# Altium project AudioBox.PrjPcb
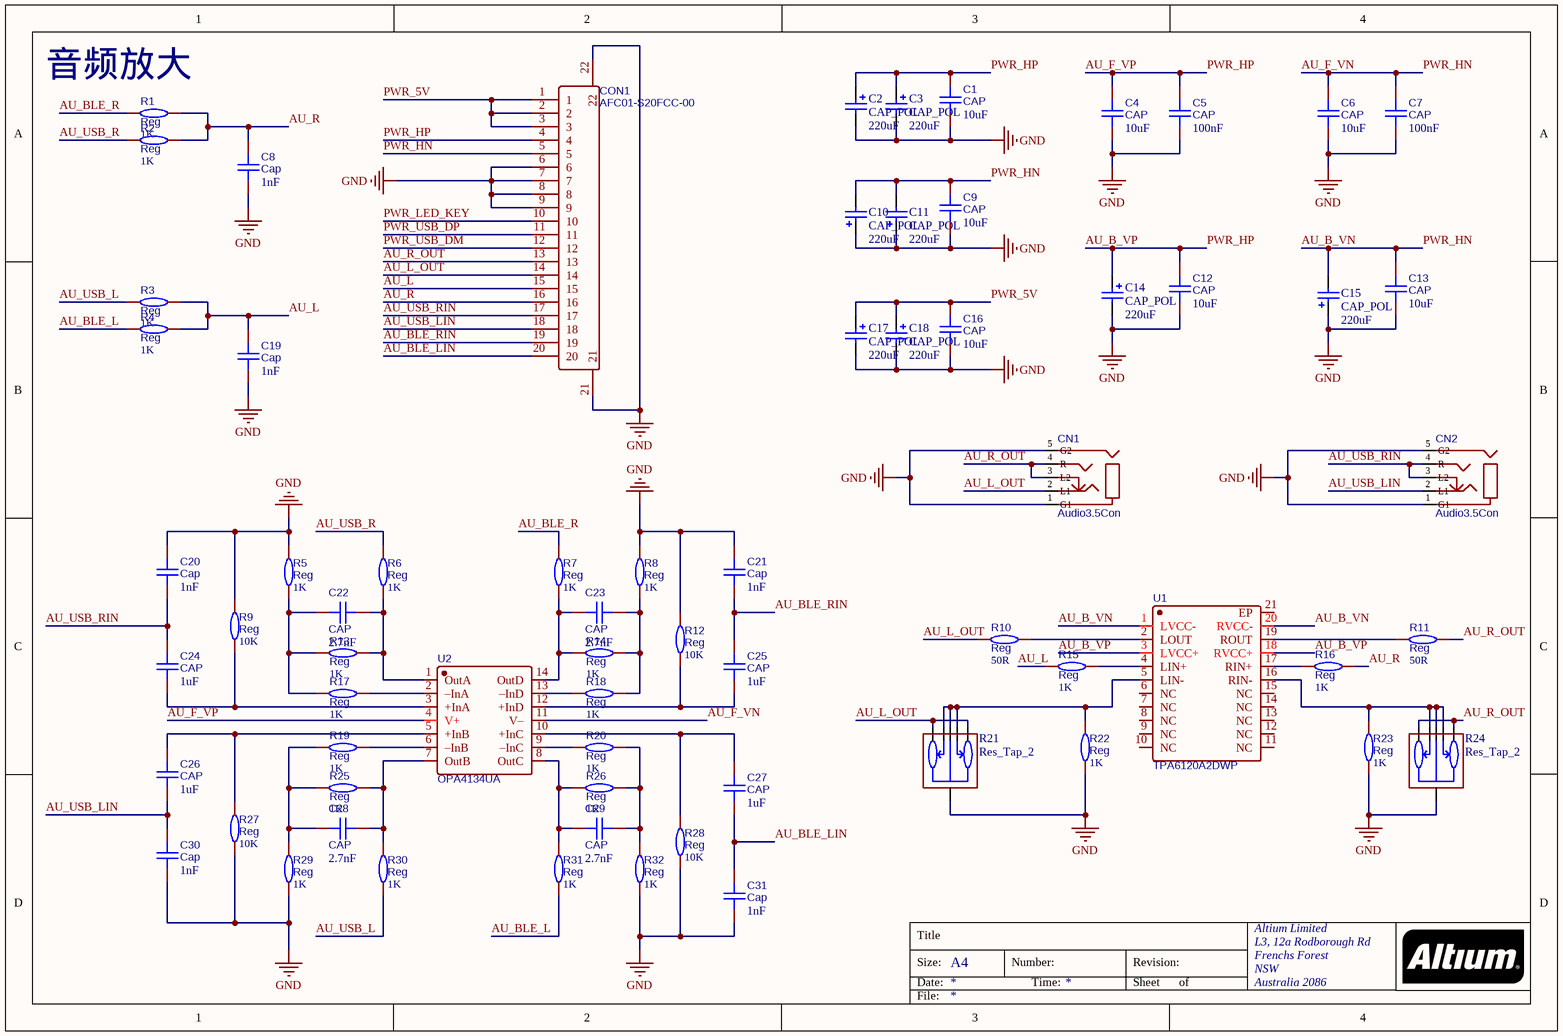
[diagram p0: Audio_Amp.SchDoc]
4 sheets, 182 parts. Net scope: global (net labels, ports and power ports of the same name join across sheets).
Board files: AudioBoxAmp.PcbDoc, Target.PcbDoc
Sheets:
  Audio_Amp.SchDoc
  Audio_Power.SchDoc
  DAC_BLE.SchDoc
  DAC_USB.SchDoc

## Sheet Audio_Amp.SchDoc
size A4; Organization: Altium Limited; Address1: L3, 12a Rodborough Rd; Address2: Frenchs Forest; Address3: NSW; Address4: Australia 2086

### Parts
C1  CAP  value 10uF  [C0603]
C2  CAP_POL  value 220uF  [CAP_SMD_6.3mm]
C3  CAP_POL  value 220uF  [CAP_SMD_6.3mm]
C4  CAP  value 10uF  [C0603]
C5  CAP  value 100nF  [C0603]
C6  CAP  value 10uF  [C0603]
C7  CAP  value 100nF  [C0603]
C8  Cap  value 1nF  [C0603]
C9  CAP  value 10uF  [C0603]
C10  CAP_POL  value 220uF  [CAP_SMD_6.3mm]
C11  CAP_POL  value 220uF  [CAP_SMD_6.3mm]
C12  CAP  value 10uF  [C0603]
C13  CAP  value 10uF  [C0603]
C14  CAP_POL  value 220uF  [CAP_SMD_6.3mm]
C15  CAP_POL  value 220uF  [CAP_SMD_6.3mm]
C16  CAP  value 10uF  [C0603]
C17  CAP_POL  value 220uF  [CAP_SMD_6.3mm]
C18  CAP_POL  value 220uF  [CAP_SMD_6.3mm]
C19  Cap  value 1nF  [C0603]
C20  Cap  value 1nF  [C0603]
C21  Cap  value 1nF  [C0603]
C22  CAP  value 2.7nF  [C0603]
C23  CAP  value 2.7nF  [C0603]
C24  CAP  value 1uF  [C0603]
C25  CAP  value 1uF  [C0603]
C26  CAP  value 1uF  [C0603]
C27  CAP  value 1uF  [C0603]
C28  CAP  value 2.7nF  [C0603]
C29  CAP  value 2.7nF  [C0603]
C30  Cap  value 1nF  [C0603]
C31  Cap  value 1nF  [C0603]
CN1  Audio3.5Con  [Audio3.5_3Pin]
CN2  Audio3.5Con  [Audio3.5_3Pin]
CON1  AFC01-S20FCC-00  [FPC-SMD_20P_0.5]
R1  Reg  value 1K  [R0603]
R2  Reg  value 1K  [R0603]
R3  Reg  value 1K  [R0603]
R4  Reg  value 1K  [R0603]
R5  Reg  value 1K  [R0603]
R6  Reg  value 1K  [R0603]
R7  Reg  value 1K  [R0603]
R8  Reg  value 1K  [R0603]
R9  Reg  value 10K  [R0603]
R10  Reg  value 50R  [R0603]
R11  Reg  value 50R  [R0603]
R12  Reg  value 10K  [R0603]
R13  Reg  value 1K  [R0603]
R14  Reg  value 1K  [R0603]
R15  Reg  value 1K  [R0603]
R16  Reg  value 1K  [R0603]
R17  Reg  value 1K  [R0603]
R18  Reg  value 1K  [R0603]
R19  Reg  value 1K  [R0603]
R20  Reg  value 1K  [R0603]
R21  Res_Tap_2  [RES_TAP_5Pin]
R22  Reg  value 1K  [R0603]
R23  Reg  value 1K  [R0603]
R24  Res_Tap_2  [RES_TAP_5Pin]
R25  Reg  value 1K  [R0603]
R26  Reg  value 1K  [R0603]
R27  Reg  value 10K  [R0603]
R28  Reg  value 10K  [R0603]
R29  Reg  value 1K  [R0603]
R30  Reg  value 1K  [R0603]
R31  Reg  value 1K  [R0603]
R32  Reg  value 1K  [R0603]
U1  TPA6120A2DWP  [HSOP-20]
U2  OPA4134UA  [SOIC-14]

### Nets
GND: C1.1 C2.2 C3.2 C4.1 C5.1 C6.1 C7.1 C8.1 C9.1 C10.1 C11.1 C12.1 C13.1 C14.2 C15.1 C16.1 C17.2 C18.2 C19.1 C20.2 C21.2 C30.2 C31.1 CN1.1(G1) CN1.5(G2) CN2.1(G1) CN2.5(G2) CON1.6 CON1.7 CON1.8 CON1.9 CON1.21 CON1.22 R5.2 R8.2 R9.1 R12.1 R21.6(PAD) R22.1 R23.1 R24.6(PAD) R27.2 R28.2 R29.1 R32.1  [project net AGND]
AU_B_VN: C6.2 C7.2 C9.2 C10.2 C11.2 C13.2 C15.2 CON1.5 U1.1(LVCC-) U1.20(RVCC-) U2.11(V–)  [also labelled AU_F_VN, PWR_HN]
AU_B_VP: C1.2 C2.1 C3.1 C4.2 C5.2 C12.2 C14.1 CON1.4 U1.3(LVCC+) U1.18(RVCC+) U2.4(V+)  [also labelled AU_F_VP, PWR_HP]
AU_BLE_L: R4.2 R31.1
AU_BLE_LIN: C27.1 C31.2 CON1.20
AU_BLE_R: R1.2 R7.2
AU_BLE_RIN: C21.1 C25.2 CON1.19
AU_L: C19.2 CON1.15 R3.1 R4.1 R15.1
AU_L_OUT: CN1.2(L1) CON1.14 R10.1 R21.4(CH2B) R21.5(CH1B)
AU_R: C8.2 CON1.16 R1.1 R2.1 R16.2
AU_R_OUT: CN1.3(L2) CN1.4(R) CON1.13 R11.2 R24.4(CH2B) R24.5(CH1B)
AU_USB_L: R3.2 R30.1
AU_USB_LIN: C26.2 C30.1 CN2.2(L1) CON1.18
AU_USB_R: R2.2 R6.2
AU_USB_RIN: C20.1 C24.1 CN2.3(L2) CN2.4(R) CON1.17
PWR_5V: C16.2 C17.1 C18.1 CON1.1 CON1.2 CON1.3
PWR_LED_KEY: CON1.10
PWR_USB_DM: CON1.12
PWR_USB_DP: CON1.11
NetC22_1: C22.1 R5.1 R13.2 R17.2
NetC22_2: C22.2 R6.1 R13.1 U2.1(OutA)
NetC23_1: C23.1 R7.1 R14.2 U2.14(OutD)
NetC23_2: C23.2 R8.1 R14.1 R18.1
NetC24_2: C24.2 R9.2 U2.3(+InA)
NetC25_1: C25.1 R12.2 U2.12(+InD)
NetC26_1: C26.1 R27.1 U2.5(+InB)
NetC27_2: C27.2 R28.1 U2.10(+InC)
NetC28_1: C28.1 R19.2 R25.2 R29.2
NetC28_2: C28.2 R25.1 R30.2 U2.7(OutB)
NetC29_1: C29.1 R26.2 R31.2 U2.8(OutC)
NetC29_2: C29.2 R20.1 R26.1 R32.2
NetR10_2: R10.2 U1.2(LOUT)
NetR11_1: R11.1 U1.19(ROUT)
NetR15_2: R15.2 U1.4(LIN+)
NetR16_1: R16.1 U1.17(RIN+)
NetR17_1: R17.1 U2.2(–InA)
NetR18_2: R18.2 U2.13(–InD)
NetR19_1: R19.1 U2.6(–InB)
NetR20_2: R20.2 U2.9(–InC)
NetR21_1: R21.1(G) R21.2(CH1A) R21.3(CH2A) R22.2 U1.5(LIN-)
NetR23_2: R23.2 R24.1(G) R24.2(CH1A) R24.3(CH2A) U1.16(RIN-)

Not connected (* = marked no-connect by the designer): U1 6(NC) 7(NC) 8(NC) 9(NC) 10(NC) 11(NC) 12(NC) 13(NC) 14(NC) 15(NC) 21(EP)

### Notes on the sheet
- (near R1) 音频放大
- Title
- Size:
- Date:
- A4
- Number:
- Time:
- Revision:
- Sheet
- of
- File:

### Library data of the parts
C1 C4-C9 C12 C13 C16 C19-C31 = CAP: BOM_Manufacturer: Huaxin S&T; BOM_Manufacturer Part: 0603B103K101CT; nameAlias: Capacitance; Contributor: LCSC; BOM_Supplier: LCSC; BOM_Supplier Part: C302008; spicePre: C; spiceSymbolName: 0603B103K101CT
C2 C3 C10 C11 C14 C15 C17 C18 = CAP_POL: 极性电容
CN1 CN2 = AudioCon3: 3.5mm 3Pin 音频接口; BOM_Manufacturer: G-Switch(品赞); BOM_Manufacturer Part: PJ-393; Contributor: LCSC; BOM_Supplier: LCSC; BOM_Supplier Part: C2837065; BOM_JLCPCB Part Class: Extended Part; spicePre: C; spiceSymbolName: PJ-393_C2837065
CON1 = FPC_CONN_20: FPC连接器20Pin; BOM_Manufacturer: JUSHUO; Contributor: LCSC; BOM_Supplier: LCSC; BOM_Supplier Part: C262274; BOM_Manufacturer Part: AFC01-S20FCC-00; BOM_JLCPCB Part Class: Extended Part; spicePre: F; spiceSymbolName: AFC01-S20FCC-00
R1-R20 R22 R23 R25-R32 = Res: 电阻; BOM_Manufacturer: Viking Tech; BOM_Manufacturer Part: AR03BTCX1002A; nameAlias: Resistance (Ohms); Contributor: LCSC; BOM_Supplier: LCSC; BOM_Supplier Part: C465721; spicePre: R; spiceSymbolName: AR03BTCX1002A
R21 R24 = Res_Tap_2: 双联电位器
U1 = TPA6120: 耳放; BOM_Manufacturer: TI(德州仪器); Contributor: LCSC; BOM_Supplier: LCSC; BOM_Supplier Part: C2871054; BOM_Manufacturer Part: TPA6120A2DWP; link: https://atta.szlcsc.comnull; spicePre: U; spiceSymbolName: TPA6120A2DWP
U2 = OPA4134UA: 耳放; BOM_Manufacturer: TI(德州仪器); Contributor: LCSC; BOM_Supplier: LCSC; BOM_Supplier Part: C2832240; BOM_Manufacturer Part: OPA4134UA; BOM_JLCPCB Part Class: Extended Part; spicePre: U; spiceSymbolName: OPA4134UA

## Sheet Audio_Power.SchDoc
size A4; Organization: Altium Limited; Address1: L3, 12a Rodborough Rd; Address2: Frenchs Forest; Address3: NSW; Address4: Australia 2086
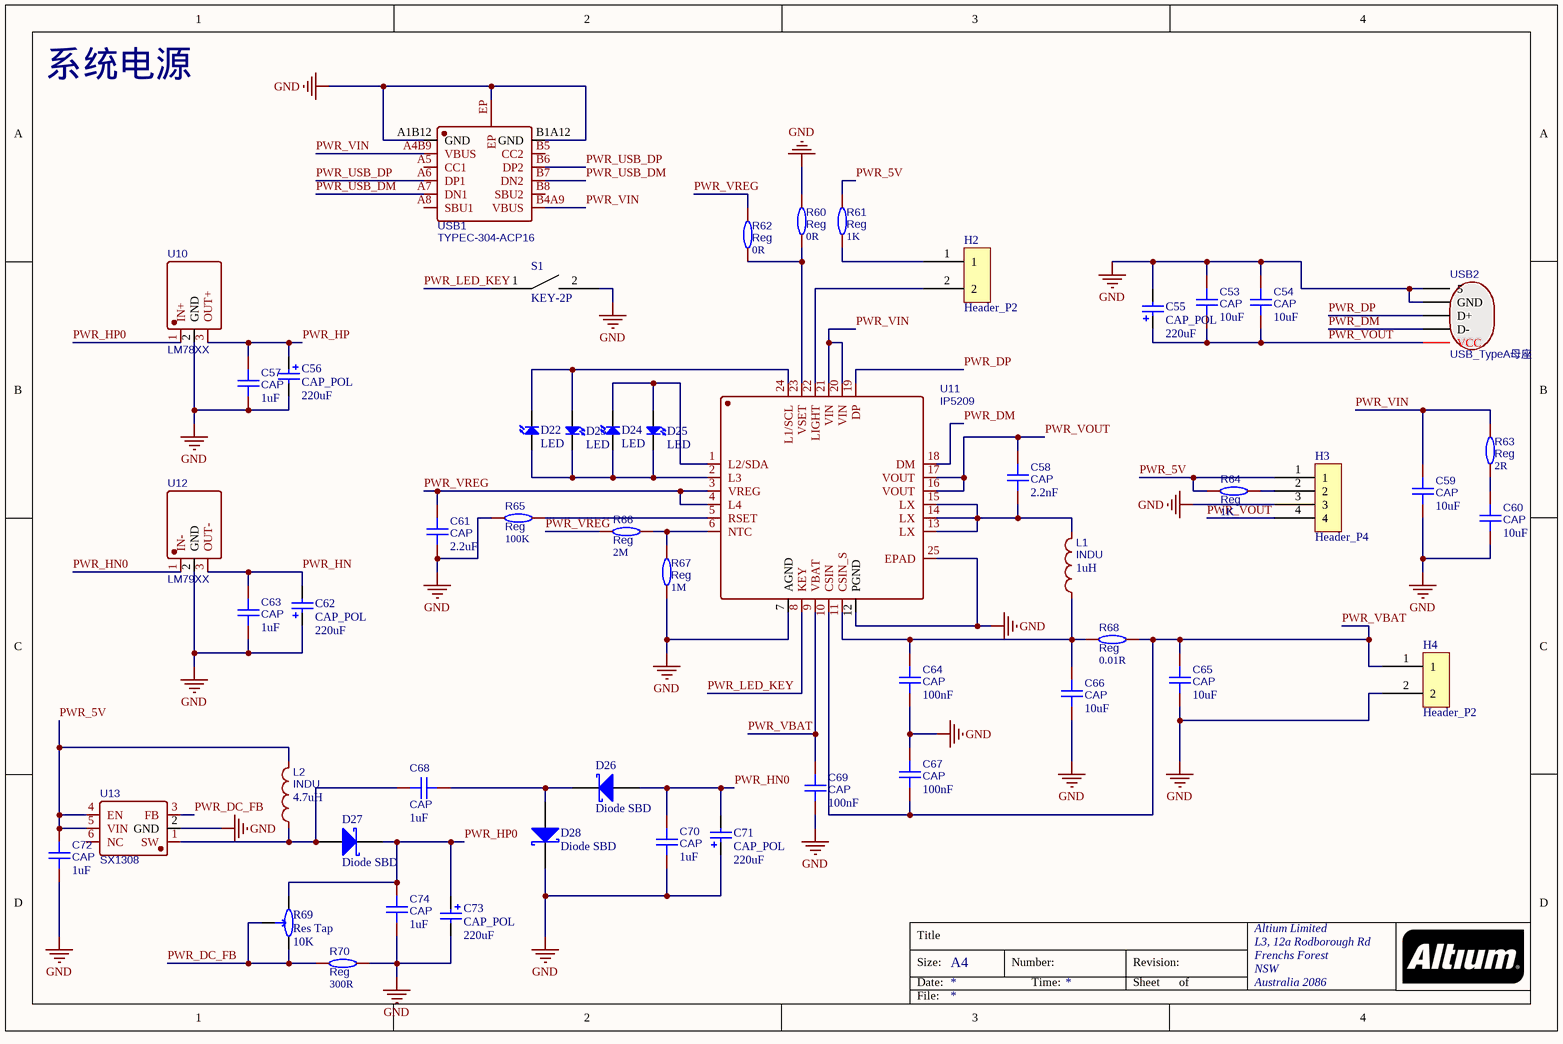
[diagram p1: Audio_Power.SchDoc]

### Parts
C53  CAP  value 10uF  [C0603]
C54  CAP  value 10uF  [C0603]
C55  CAP_POL  value 220uF  [CAP_SMD_6.3mm]
C56  CAP_POL  value 220uF  [CAP_SMD_6.3mm]
C57  CAP  value 1uF  [C0603]
C58  CAP  value 2.2nF  [C0603]
C59  CAP  value 10uF  [C0603]
C60  CAP  value 10uF  [C0603]
C61  CAP  value 2.2uF  [C0603]
C62  CAP_POL  value 220uF  [CAP_SMD_6.3mm]
C63  CAP  value 1uF  [C0603]
C64  CAP  value 100nF  [C0603]
C65  CAP  value 10uF  [C0603]
C66  CAP  value 10uF  [C0603]
C67  CAP  value 100nF  [C0603]
C68  CAP  value 1uF  [C0603]
C69  CAP  value 100nF  [C0603]
C70  CAP  value 1uF  [C0603]
C71  CAP_POL  value 220uF  [CAP_SMD_6.3mm]
C72  CAP  value 1uF  [C0603]
C73  CAP_POL  value 220uF  [CAP_SMD_6.3mm]
C74  CAP  value 1uF  [C0603]
D22  LED  [LED0603_Side]
D23  LED  [LED0603_Side]
D24  LED  [LED0603_Side]
D25  LED  [LED0603_Side]
D26  Diode SBD  [SMA_L4.3]
D27  Diode SBD  [SMA_L4.3]
D28  Diode SBD  [SMA_L4.3]
H2  Header_P2  [H_2.54_P2]
H3  Header_P4  [H_2.54_P4]
H4  Header_P2  [H_2.54_P2]
L1  INDU  value 1uH  [SMD_L7.1]
L2  INDU  value 4.7uH  [SMD_L7.1]
R60  Reg  value 0R  [R0603]
R61  Reg  value 1K  [R0603]
R62  Reg  value 0R  [R0603]
R63  Reg  value 2R  [R0603]
R64  Reg  value 1K  [R0603]
R65  Reg  value 100K  [R0603]
R66  Reg  value 2M  [R0603]
R67  Reg  value 1M  [R0603]
R68  Reg  value 0.01R  [R1206]
R69  Res Tap  value 10K  [RES_TAP_HOR]
R70  Reg  value 300R  [R0603]
S1  KEY-2P  [KEY_SOT_P2]
U10  LM78XX  [TO-220-3_2.54]
U11  IP5209  [QFN-24]
U12  LM79XX  [TO-220-3_2.54]
U13  SX1308  [SOT-23-6]
USB1  TYPEC-304-ACP16  [USB-C-SMD_TYPE-C-16P]
USB2  USB_TypeA母座  [USB_TYPEA-SMD]

### Nets
GND: C53.1 C54.1 C55.2 C56.2 C57.2 C59.2 C60.2 C61.2 C62.1 C63.2 C64.2 C65.2 C66.2 C67.1 C69.2 C70.2 C71.1 C72.2 C73.2 C74.2 D28.1(K) H3.3 H4.2 R60.2 R65.2 R67.2 R70.2 S1.2 U10.2(GND) U11.7(AGND) U11.12(PGND) U11.25(EPAD) U12.2(GND) U13.2(GND) USB1.A1B12(GND) USB1.B1A12(GND) USB1.EP USB2.4(GND) USB2.5  [project net AGND]
PWR_5V: C72.1 H3.1 L2.2 R61.2 R64.1 U13.4(EN) U13.5(VIN)
PWR_DC_FB: R69.1(A) R69.3(TAP) R70.1 U13.3(FB)
PWR_DM: U11.18(DM) USB2.2(D-)
PWR_DP: U11.19(DP) USB2.3(D+)
PWR_HN: C62.2 C63.1 U12.3(OUT-)  [project net AU_B_VN]
PWR_HN0: C70.1 C71.2 D26.2(A) U12.1(IN-)
PWR_HP: C56.1 C57.1 U10.3(OUT+)  [project net AU_B_VP]
PWR_HP0: C73.1 C74.1 D27.1(K) R69.2(B) U10.1(IN+)
PWR_LED_KEY: S1.1 U11.8(KEY)
PWR_USB_DM: USB1.A7(DN1) USB1.B7(DN2)
PWR_USB_DP: USB1.A6(DP1) USB1.B6(DP2)
PWR_VBAT: C65.1 C67.2 C69.1 H4.1 R68.2 U11.9(VBAT) U11.10(CSIN)
PWR_VIN: C59.1 R63.2 U11.20(VIN) U11.21(VIN) USB1.A4B9(VBUS) USB1.B4A9(VBUS)
PWR_VOUT: C53.2 C54.2 C55.1 C58.1 H3.4 U11.16(VOUT) U11.17(VOUT) USB2.1(VCC)
PWR_VREG: C61.1 R62.2 R66.2 U11.3(VREG) U11.4(L4)
NetC58_2: C58.2 L1.2 U11.13(LX) U11.14(LX) U11.15(LX)
NetC60_1: C60.1 R63.1
NetC64_1: C64.1 C66.1 L1.1 R68.1 U11.11(CSIN_S)
NetC68_1: C68.1 D27.2(A) L2.1 U13.1(SW)
NetC68_2: C68.2 D26.1(K) D28.2(A)
NetD22_1: D22.1(K) D23.2(A) U11.24(L1/SCL)
NetD22_2: D22.2(A) D23.1(K) D24.2(A) D25.1(K) U11.2(L3)
NetD24_1: D24.1(K) D25.2(A) U11.1(L2/SDA)
NetH2_1: H2.1 R61.1
NetH2_2: H2.2 U11.22(LIGHT)
NetH3_2: H3.2 R64.2
NetR60_1: R60.1 R62.1 U11.23(VSET)
NetR65_1: R65.1 U11.5(RSET)
NetR66_1: R66.1 R67.1 U11.6(NTC)

Not connected (* = marked no-connect by the designer): U13 6(NC); USB1 A5(CC1) A8(SBU1) B5(CC2) B8(SBU2)

### Notes on the sheet
- 系统电源
- Title
- Size:
- Date:
- A4
- Number:
- Time:
- Revision:
- Sheet
- of
- File:

### Library data of the parts
C53 C54 C57-C61 C63-C70 C72 C74 = CAP: as C1 on sheet Audio_Amp; BOM_Supplier: LCSC; BOM_Supplier Part: C302008; spicePre: C; spiceSymbolName: 0603B103K101CT
C55 C56 C62 C71 C73 = CAP_POL: 极性电容
D22-D25 = LED0: Published: 8-Jun-2000; LatestRevisionDate: 08-Jul-2005; LatestRevisionNote: Mech Layer 1 removed.; PackageReference: LED-0; Publisher: Altium Limited; PackageDescription: LED; 2 Leads
D26-D28 = Diode SBD: Schottky Rectifier; Note: Terminal 2 is the TAB and is electrically connected to the cathode; Published: 8-Jun-2000; LatestRevisionDate: 17-Jul-2002; LatestRevisionNote: Re-released for DXP Platform.; DatasheetVersion: PD-2.057B; PackageVersion: Feb-1998; PackageReference: TO-220AC; Publisher: Altium Limited; PackageDescription: TO, Thru-Hole, Vertical, Heatsink Mounted; 3 In-Line Leads (1 Absent); Pitch 2.54 mm; ComponentLink1Description: Manufacturer Link; ComponentLink1URL: http://www.irf.com/; ComponentLink2Description: Datasheet; ComponentLink2URL: http://www.irf.com/product-info/datasheets/data/10tq.pdf
H2 H4 = Header_P2: 2Pin排针
H3 = Header_P4: 4Pin排针
L1 L2 = IND: 电感; BOM_Manufacturer: Sunltech Tech; BOM_Manufacturer Part: SLO0630H150MTT; nameAlias: Inductance; Contributor: LCSC; BOM_Supplier: LCSC; BOM_Supplier Part: C182182; BOM_JLCPCB Part Class: Extended Part; spicePre: L; spiceSymbolName: SLO0630H150MTT
R60-R68 R70 = Res: as R1 on sheet Audio_Amp; BOM_Supplier: LCSC; BOM_Supplier Part: C465721; spicePre: R; spiceSymbolName: AR03BTCX1002A
R69 = Res Tap: 可调电阻; Sim Note: Enter the Resistance value and the set point into parameter fields.; Set Position: 0.5; Published: 24-Mar-1999; LatestRevisionDate: 17-Jul-2002; LatestRevisionNote: Re-released for DXP Platform.; PackageReference: VR3; Publisher: Altium Limited; PackageDescription: Variable Resistor, Thru-Hole; 3 Leads
S1 = KEY_2P: KEY-2Pp
U10 = LM78XX: 三端稳压(正电压); BOM_Manufacturer: HGSEMI(华冠); BOM_Manufacturer Part: LM7812T; Contributor: LCSC; BOM_Supplier: LCSC; BOM_Supplier Part: C2902509; BOM_JLCPCB Part Class: Extended Part; spicePre: U; spiceSymbolName: LM7812T
U11 = IP5209: USB充电宝; BOM_Manufacturer: INJOINIC; Contributor: LCSC; BOM_Supplier: LCSC; BOM_Supplier Part: C181695; BOM_Manufacturer Part: IP5209; BOM_JLCPCB Part Class: Extended Part; spicePre: U; spiceSymbolName: IP5209
U12 = LM79XX: 三端稳压(负电压); BOM_Manufacturer: HGSEMI(华冠); BOM_Manufacturer Part: LM7812T; Contributor: LCSC; BOM_Supplier: LCSC; BOM_Supplier Part: C2902509; BOM_JLCPCB Part Class: Extended Part; spicePre: U; spiceSymbolName: LM7812T
U13 = SX1308: 升压PWM; BOM_Manufacturer: SX; sourceId: g4Yg9rJ1j; timeStamp: 1472247539; BOM_Supplier: LCSC; BOM_Manufacturer Part: SX1308; BOM_Supplier Part: C78162; BOM_JLCPCB Part Class: Extended Part; spicePre: U; spiceSymbolName: SX1308
USB1 = USB_TYPEC_12P: 全引脚USB TYPEC母座; BOM_Manufacturer: XUNPU(讯普); Contributor: LCSC; BOM_Supplier: LCSC; BOM_Supplier Part: C2982555; BOM_Manufacturer Part: TYPEC-304-ACP16; BOM_JLCPCB Part Class: Extended Part; spicePre: U; spiceSymbolName: TYPEC-304-ACP16
USB2 = USB-TYPEA: BOM_Manufacturer: ValuePro; BOM_Manufacturer Part: YJ-USB-AF-SMT-01; BOM_Supplier: LCSC; BOM_Supplier Part: C8328; BOM_JLCPCB Part Class: Extended Part; spicePre: U; spiceSymbolName: YJ-USB-AF-SMT-01

## Sheet DAC_BLE.SchDoc
size A4; Organization: Altium Limited; Address1: L3, 12a Rodborough Rd; Address2: Frenchs Forest; Address3: NSW; Address4: Australia 2086
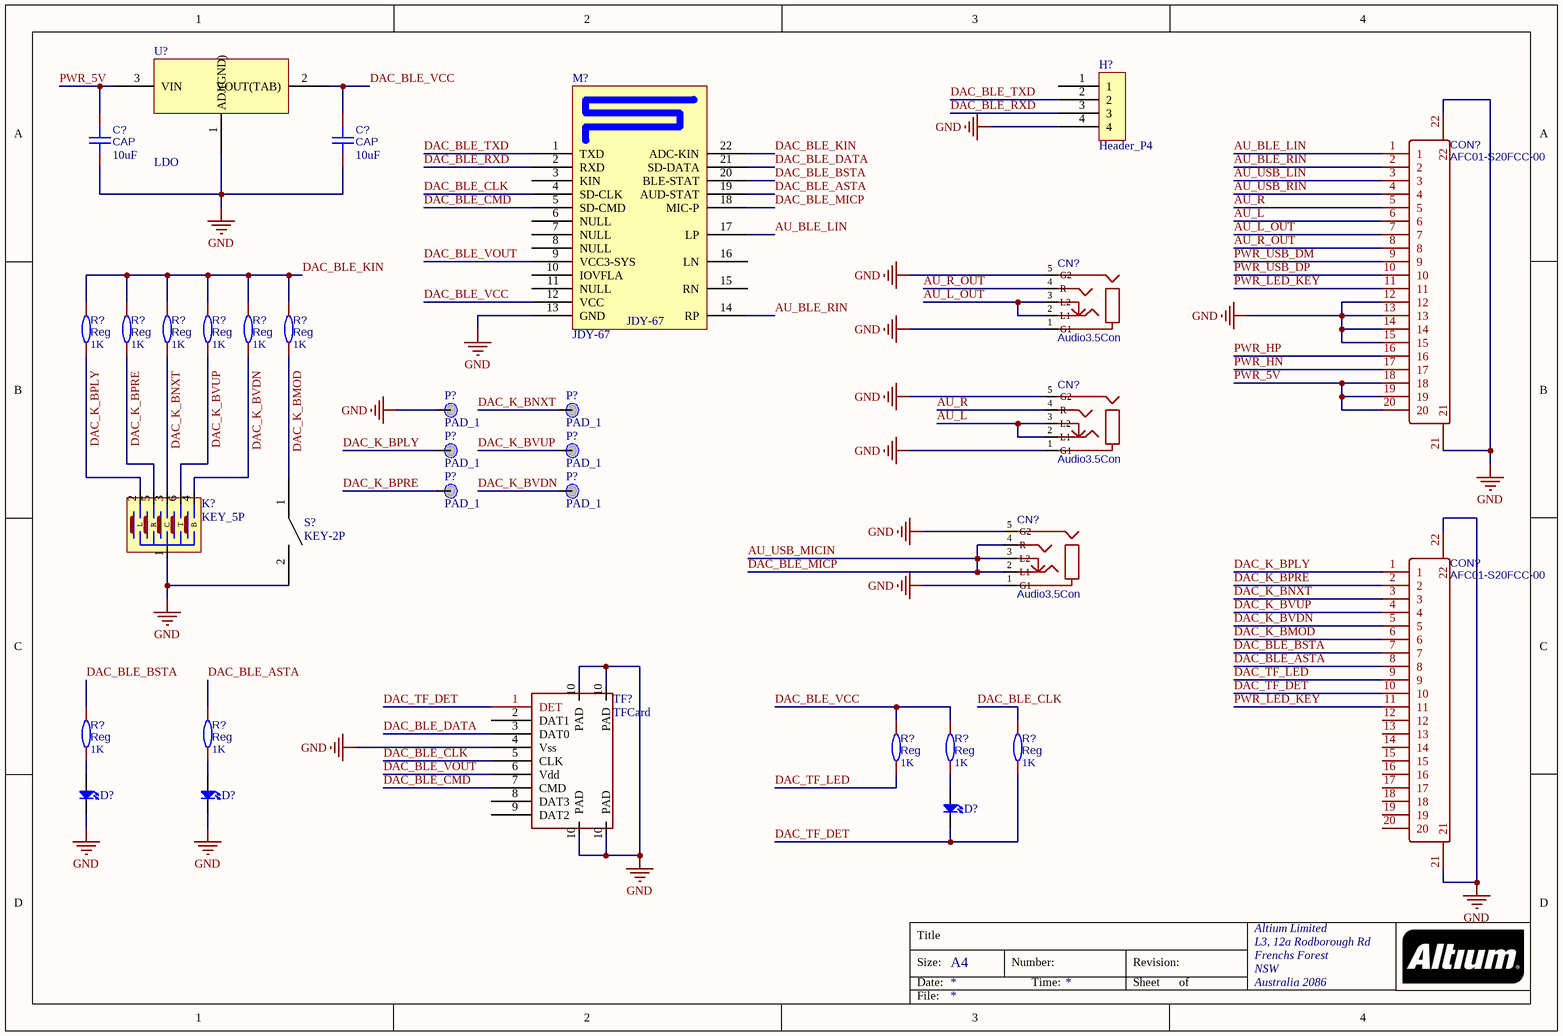
[diagram p2: DAC_BLE.SchDoc]

### Parts
(Parts that share a designator on the sheet are numbered #1, #2 ... from top to bottom, then left to right.)
C?#1  CAP  value 10uF  [C0603]
C?#2  CAP  value 10uF  [C0603]
CN?#1  Audio3.5Con  [Audio3.5_3Pin]
CN?#2  Audio3.5Con  [Audio3.5_3Pin]
CN?#3  Audio3.5Con  [Audio3.5_3Pin]
CON?#1  AFC01-S20FCC-00  [FPC-SMD_20P_0.5]
CON?#2  AFC01-S20FCC-00  [FPC-SMD_20P_0.5]
D?#1  LED  [LED0603]  (value not drawn)
D?#2  LED  [LED0603]  (value not drawn)
D?#3  LED  [LED0603]  (value not drawn)
H?  Header_P4  [H_1.27_P4]
K?#1  KEY_5P  [KEY_5]
M?  JDY-67  [JDY-67]
P?#1  PAD_1
P?#2  PAD_1
P?#3  PAD_1
P?#4  PAD_1
P?#5  PAD_1
P?#6  PAD_1
R?#1  Reg  value 1K  [R0603]
R?#2  Reg  value 1K  [R0603]
R?#3  Reg  value 1K  [R0603]
R?#4  Reg  value 1K  [R0603]
R?#5  Reg  value 1K  [R0603]
R?#6  Reg  value 1K  [R0603]
R?#7  Reg  value 1K  [R0603]
R?#8  Reg  value 1K  [R0603]
R?#9  Reg  value 1K  [R0603]
R?#10  Reg  value 1K  [R0603]
R?#11  Reg  value 1K  [R0603]
S?  KEY-2P  [KEY_SOT_P2]
TF?  TFCard
U?#1  LDO  [SOT-89]

### Nets
GND: C?#1.2 C?#2.2 CN?#1.1(G1) CN?#1.5(G2) CN?#2.1(G1) CN?#2.5(G2) CN?#3.1(G1) CN?#3.5(G2) CON?#1.12 CON?#1.13 CON?#1.14 CON?#1.15 CON?#1.21 CON?#1.22 CON?#2.21 CON?#2.22 D?#1.1(K) D?#2.1(K) H?.4 K?#1.1(G) M?.13(GND) P?#1.1 S?.2 TF?.4(Vss) TF?.10(PAD) U?#1.1(ADJ(GND))  [project net AGND]
AU_BLE_LIN: CON?#1.1 M?.17(LP)
AU_BLE_RIN: CON?#1.2 M?.14(RP)
AU_L: CN?#2.2(L1) CN?#2.3(L2) CON?#1.6
AU_L_OUT: CN?#1.2(L1) CN?#1.3(L2) CON?#1.7
AU_R: CN?#2.4(R) CON?#1.5
AU_R_OUT: CN?#1.4(R) CON?#1.8
AU_USB_LIN: CON?#1.3
AU_USB_MICIN: CN?#3.2(L1) CN?#3.3(L2) CN?#3.4(R) M?.18(MIC-P)  [also labelled DAC_BLE_MICP]
AU_USB_RIN: CON?#1.4
DAC_BLE_ASTA: CON?#2.8 M?.19(AUD-STAT) R?#8.2
DAC_BLE_BSTA: CON?#2.7 M?.20(BLE-STAT) R?#7.2
DAC_BLE_CLK: M?.4(SD-CLK) R?#11.2 TF?.5(CLK)
DAC_BLE_CMD: M?.5(SD-CMD) TF?.7(CMD)
DAC_BLE_DATA: M?.21(SD-DATA) TF?.3(DAT0)
DAC_BLE_KIN: M?.22(ADC-KIN) R?#1.2 R?#2.2 R?#3.2 R?#4.2 R?#5.2 R?#6.2
DAC_BLE_RXD: H?.3 M?.2(RXD)
DAC_BLE_TXD: H?.2 M?.1(TXD)
DAC_BLE_VCC: C?#2.1 M?.12(VCC) R?#9.2 R?#10.2 U?#1.2(VOUT(TAB))
DAC_BLE_VOUT: M?.9(VCC3-SYS) TF?.6(Vdd)
DAC_K_BMOD: CON?#2.6 R?#6.1 S?.1
DAC_K_BNXT: CON?#2.3 K?#1.3(C) P?#2.1 R?#3.1
DAC_K_BPLY: CON?#2.1 K?#1.2(L) P?#3.1 R?#1.1
DAC_K_BPRE: CON?#2.2 K?#1.5(R) P?#5.1 R?#2.1
DAC_K_BVDN: CON?#2.5 K?#1.4(B) P?#6.1 R?#5.1
DAC_K_BVUP: CON?#2.4 K?#1.6(T) P?#4.1 R?#4.1
DAC_TF_DET: CON?#2.10 D?#3.1(K) R?#11.1 TF?.1(DET)
DAC_TF_LED: CON?#2.9 R?#9.1
PWR_5V: C?#1.1 CON?#1.18 CON?#1.19 CON?#1.20 U?#1.3(VIN)
PWR_HN: CON?#1.17  [project net AU_B_VN]
PWR_HP: CON?#1.16  [project net AU_B_VP]
PWR_LED_KEY: CON?#1.11 CON?#2.11
PWR_USB_DM: CON?#1.9
PWR_USB_DP: CON?#1.10
NetD?#1_2: D?#1.2(A) R?#7.1
NetD?#2_2: D?#2.2(A) R?#8.1
NetD?#3_2: D?#3.2(A) R?#10.1

Not connected (* = marked no-connect by the designer): CON?#2 12 13 14 15 16 17 18 19 20; H? 1; M? 3(KIN) 6(NULL) 7(NULL) 8(NULL) 10(IOVFLA) 11(NULL) 15(RN) 16(LN); TF? 2(DAT1) 8(DAT3) 9(DAT2)

### Notes on the sheet
- Title
- Size:
- Date:
- A4
- Number:
- Time:
- Revision:
- Sheet
- of
- File:

### Library data of the parts
C?#1 C?#2 = CAP: as C1 on sheet Audio_Amp; BOM_Supplier: LCSC; BOM_Supplier Part: C302008; spicePre: C; spiceSymbolName: 0603B103K101CT
CN?#1-CN?#3 = AudioCon3: as CN1 on sheet Audio_Amp; BOM_Supplier: LCSC; BOM_Supplier Part: C2837065; BOM_JLCPCB Part Class: Extended Part; spicePre: C; spiceSymbolName: PJ-393_C2837065
CON?#1 CON?#2 = FPC_CONN_20: as CON1 on sheet Audio_Amp; BOM_Supplier: LCSC; BOM_Supplier Part: C262274; BOM_Manufacturer Part: AFC01-S20FCC-00; BOM_JLCPCB Part Class: Extended Part; spicePre: F; spiceSymbolName: AFC01-S20FCC-00
D?#1-D?#3 = LED0: Published: 8-Jun-2000; LatestRevisionDate: 08-Jul-2005; LatestRevisionNote: Mech Layer 1 removed.; PackageReference: LED-0; Publisher: Altium Limited; PackageDescription: LED; 2 Leads
H? = Header_P4: 4Pin排针
K?#1 = KEY_5P: 五向开关
P?#1-P?#6 = PAD_1: 1脚焊盘
R?#1-R?#11 = Res: as R1 on sheet Audio_Amp; BOM_Supplier: LCSC; BOM_Supplier Part: C465721; spicePre: R; spiceSymbolName: AR03BTCX1002A
S? = KEY_2P: KEY-2Pp
TF? = TFCard: TF卡座
U?#1 = AMS1117

## Sheet DAC_USB.SchDoc
size A4; Organization: Altium Limited; Address1: L3, 12a Rodborough Rd; Address2: Frenchs Forest; Address3: NSW; Address4: Australia 2086
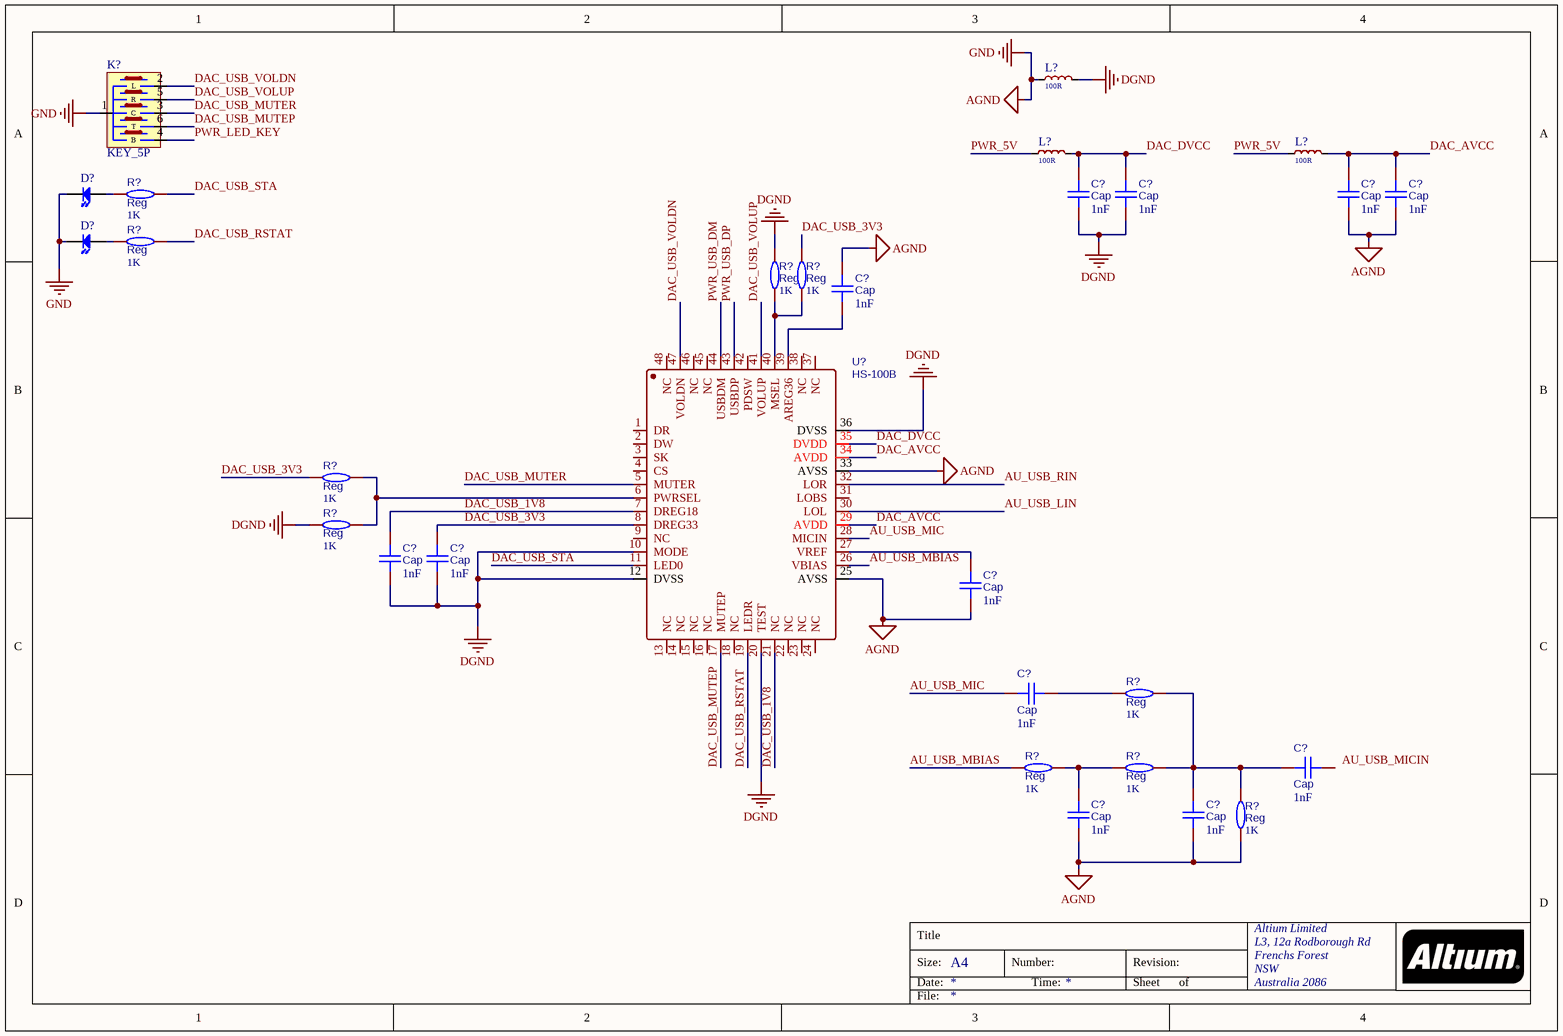
[diagram p3: DAC_USB.SchDoc]

### Parts
(Parts that share a designator on the sheet are numbered #1, #2 ... from top to bottom, then left to right.)
C?#3  Cap  value 1nF  [C0603]
C?#4  Cap  value 1nF  [C0603]
C?#5  Cap  value 1nF  [C0603]
C?#6  Cap  value 1nF  [C0603]
C?#7  Cap  value 1nF  [C0603]
C?#8  Cap  value 1nF  [C0603]
C?#9  Cap  value 1nF  [C0603]
C?#10  Cap  value 1nF  [C0603]
C?#11  Cap  value 1nF  [C0603]
C?#12  Cap  value 1nF  [C0603]
C?#13  Cap  value 1nF  [C0603]
C?#14  Cap  value 1nF  [C0603]
D?#4  LED  [LED0603]  (value not drawn)
D?#5  LED  [LED0603]  (value not drawn)
K?#2  KEY_5P  [KEY_5]
L?#1  value 100R  [L0603]  (hidden comment: 电感磁珠)
L?#2  value 100R  [L0603]  (hidden comment: 电感磁珠)
L?#3  value 100R  [L0603]  (hidden comment: 电感磁珠)
R?#12  Reg  value 1K  [R0603]
R?#13  Reg  value 1K  [R0603]
R?#14  Reg  value 1K  [R0603]
R?#15  Reg  value 1K  [R0603]
R?#16  Reg  value 1K  [R0603]
R?#17  Reg  value 1K  [R0603]
R?#18  Reg  value 1K  [R0603]
R?#19  Reg  value 1K  [R0603]
R?#20  Reg  value 1K  [R0603]
R?#21  Reg  value 1K  [R0603]
U?#2  HS-100B  [LQFP-48_L7.0-W7.0-P0.50-LS9.0-BL]

### Nets
AGND: C?#5.2 C?#6.2 C?#7.1 C?#10.2 C?#13.2 C?#14.2 D?#4.1(K) D?#5.1(K) K?#2.1(G) L?#1.1 R?#21.1 U?#2.25(AVSS) U?#2.33(AVSS)  [also labelled GND]
DGND: C?#3.2 C?#4.2 C?#8.2 C?#9.2 L?#1.2 R?#14.2 R?#17.2 U?#2.10(MODE) U?#2.12(DVSS) U?#2.20(TEST) U?#2.36(DVSS)
AU_USB_LIN: U?#2.30(LOL)
AU_USB_MBIAS: R?#19.1 U?#2.26(VBIAS)
AU_USB_MIC: C?#11.1 U?#2.28(MICIN)
AU_USB_RIN: U?#2.32(LOR)
DAC_AVCC: C?#5.1 C?#6.1 L?#3.2 U?#2.29(AVDD) U?#2.34(AVDD)
DAC_DVCC: C?#3.1 C?#4.1 L?#2.2 U?#2.35(DVDD)
DAC_USB_1V8: C?#8.1 U?#2.7(DREG18) U?#2.21(NC)
DAC_USB_3V3: C?#9.1 R?#15.2 R?#16.2 U?#2.8(DREG33)
DAC_USB_MUTEP: K?#2.6(T) U?#2.17(MUTEP)
DAC_USB_MUTER: K?#2.3(C) U?#2.5(MUTER)
DAC_USB_RSTAT: R?#13.1 U?#2.19(LEDR)
DAC_USB_STA: R?#12.1 U?#2.11(LED0)
DAC_USB_VOLDN: K?#2.2(L) U?#2.47(VOLDN)
DAC_USB_VOLUP: K?#2.5(R) U?#2.41(VOLUP)
PWR_5V: L?#2.1 L?#3.1
PWR_LED_KEY: K?#2.4(B)
PWR_USB_DM: U?#2.44(USBDM)
PWR_USB_DP: U?#2.43(USBDP)
NetC?#7_2: C?#7.2 U?#2.39(AREG36)
NetC?#10_1: C?#10.1 U?#2.27(VREF)
NetC?#11_2: C?#11.2 R?#18.1
NetC?#12_1: C?#12.1 C?#14.1 R?#18.2 R?#20.2 R?#21.2
NetC?#13_1: C?#13.1 R?#19.2 R?#20.1
NetD?#4_2: D?#4.2(A) R?#12.2
NetD?#5_2: D?#5.2(A) R?#13.2
NetR?#14_1: R?#14.1 R?#15.1 U?#2.40(MSEL)
NetR?#16_1: R?#16.1 R?#17.1 U?#2.6(PWRSEL)

Not connected (* = marked no-connect by the designer): C?#12 2; U?#2 1(DR) 2(DW) 3(SK) 4(CS) 9(NC) 13(NC) 14(NC) 15(NC) 16(NC) 18(NC) 22(NC) 23(NC) 24(NC) 31(LOBS) 37(NC) 38(NC) 42(PDSW) 45(NC) 46(NC) 48(NC)

### Notes on the sheet
- Labels drawn without touching a wire or pin: AU_USB_MICIN
- Title
- Size:
- Date:
- A4
- Number:
- Time:
- Revision:
- Sheet
- of
- File:

### Library data of the parts
C?#3-C?#14 = CAP: as C1 on sheet Audio_Amp; BOM_Supplier: LCSC; BOM_Supplier Part: C302008; spicePre: C; spiceSymbolName: 0603B103K101CT
D?#4 D?#5 = LED0: Published: 8-Jun-2000; LatestRevisionDate: 08-Jul-2005; LatestRevisionNote: Mech Layer 1 removed.; PackageReference: LED-0; Publisher: Altium Limited; PackageDescription: LED; 2 Leads
K?#2 = KEY_5P: 五向开关
L?#1-L?#3 = IND_FB
R?#12-R?#21 = Res: as R1 on sheet Audio_Amp; BOM_Supplier: LCSC; BOM_Supplier Part: C465721; spicePre: R; spiceSymbolName: AR03BTCX1002A
U?#2 = HS-100B: HS-100B USB Audio; BOM_Manufacturer: Cmedia; Contributor: LCSC; BOM_Supplier: LCSC; BOM_Supplier Part: C371351; BOM_Manufacturer Part: HS-100B; BOM_JLCPCB Part Class: Extended Part; spicePre: U; spiceSymbolName: HS-100B

## Nets that join several sheets
AGND: Audio_Amp (45 pins), Audio_Power (39 pins), DAC_BLE (26 pins), DAC_USB (13 pins)
AU_B_VN: Audio_Amp (11 pins), Audio_Power (C62.2 C63.1 U12.3), DAC_BLE (CON?#1.17)
AU_B_VP: Audio_Amp (11 pins), Audio_Power (C56.1 C57.1 U10.3), DAC_BLE (CON?#1.16)
AU_BLE_LIN: Audio_Amp (C27.1 C31.2 CON1.20), DAC_BLE (CON?#1.1 M?.17)
AU_BLE_RIN: Audio_Amp (C21.1 C25.2 CON1.19), DAC_BLE (CON?#1.2 M?.14)
AU_L: Audio_Amp (5 pins), DAC_BLE (CN?#2.2 CN?#2.3 CON?#1.6)
AU_L_OUT: Audio_Amp (5 pins), DAC_BLE (CN?#1.2 CN?#1.3 CON?#1.7)
AU_R: Audio_Amp (5 pins), DAC_BLE (CN?#2.4 CON?#1.5)
AU_R_OUT: Audio_Amp (6 pins), DAC_BLE (CN?#1.4 CON?#1.8)
AU_USB_LIN: Audio_Amp (C26.2 C30.1 CN2.2 CON1.18), DAC_BLE (CON?#1.3), DAC_USB (U?#2.30)
AU_USB_RIN: Audio_Amp (5 pins), DAC_BLE (CON?#1.4), DAC_USB (U?#2.32)
PWR_5V: Audio_Amp (6 pins), Audio_Power (7 pins), DAC_BLE (5 pins), DAC_USB (L?#2.1 L?#3.1)
PWR_LED_KEY: Audio_Amp (CON1.10), Audio_Power (S1.1 U11.8), DAC_BLE (CON?#1.11 CON?#2.11), DAC_USB (K?#2.4)
PWR_USB_DM: Audio_Amp (CON1.12), Audio_Power (USB1.A7 USB1.B7), DAC_BLE (CON?#1.9), DAC_USB (U?#2.44)
PWR_USB_DP: Audio_Amp (CON1.11), Audio_Power (USB1.A6 USB1.B6), DAC_BLE (CON?#1.10), DAC_USB (U?#2.43)